# Altium schematic sheet pca10112_sheet8_FEM.SchDoc: Front End Module
size A3; Organization: Nordic Semiconductor; DocumentNumber: 7; SheetNumber: 7; SheetTotal: 7; CompanyName: Nordic Semiconductor; ProjectName: pca10112.PrjPCB
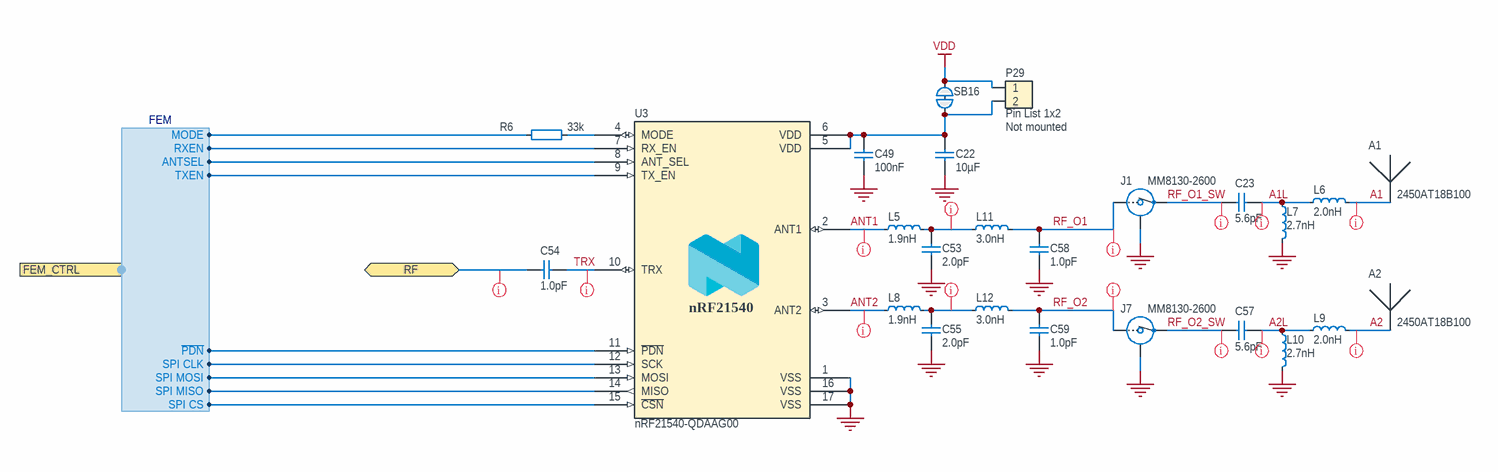
[diagram p0: pca10112_sheet8_FEM.SchDoc]

## Parts
A1  2450AT18B100  [2450AT18B100]
A2  2450AT18B100  [2450AT18B100]
C22  10µF  [CAPC1608X06L]
C23  5.6pF  [CAPC0603X03L_C]
C49  100nF  [CAPC0603X03L_C]
C53  2.0pF  [CAPC0603X03L_C]
C54  1.0pF  [CAPC0603X03L_C]
C55  2.0pF  [CAPC0603X03L_C]
C57  5.6pF  [CAPC0603X03L_C]
C58  1.0pF  [CAPC0603X03L_C]
C59  1.0pF  [CAPC0603X03L_C]
J1  MM8130-2600  [COAXIAL-SWF]
J7  MM8130-2600  [COAXIAL-SWF]
L5  1.9nH  [INDC0603X03L_C]
L6  2.0nH  [INDC0603X03L_C]
L7  2.7nH  [INDC0603X03L_C]
L8  1.9nH  [INDC0603X03L_C]
L9  2.0nH  [INDC0603X03L_C]
L10  2.7nH  [INDC0603X03L_C]
L11  3.0nH  [INDC0603X03L_C]
L12  3.0nH  [INDC0603X03L_C]
P29  Pin List 1x2  Assembly: Not mounted  [LIST_1x2-NC]
R6  33k  [RESC0603X03L_C]
SB16  Solderbridge  [Solderbridge_Shorted]  (value not drawn)  (net tie, no BOM)
U3  nRF21540-QDAAG00  [QFN65P400X400X65_HS-17N]

## Ports
FEM_CTRL (harness FEM), RF (bidir)

## Harnesses
FEM: MODE, RXEN, ANTSEL, TXEN, ~{PDN}, SPI CLK, SPI MOSI, SPI MISO, SPI CS

## Nets
GND: C22.1 C49.1 C53.1 C55.1 C58.1 C59.1 J1.2(Shield) J7.2(Shield) L7.2 L10.2 U3.1(VSS) U3.16(VSS) U3.17(VSS)
VDD: P29.1 SB16.1
A1: A1.1 L6.2
A1L: C23.1 L6.1 L7.1
A2: A2.1 L9.2
A2L: C57.1 L9.1 L10.1
ANT1: L5.1 U3.2(ANT1)
ANT2: L8.1 U3.3(ANT2)
RF: C54.1 ; port RF
RF_O1: C58.2 J1.1(IN) L11.2
RF_O1_SW: C23.2 J1.3(OUT)
RF_O2: C59.2 J7.1(IN) L12.2
RF_O2_SW: C57.2 J7.3(OUT)
TRX: C54.2 U3.10(TRX)
NetC22_2: C22.2 C49.2 P29.2 SB16.2 U3.5(VDD) U3.6(VDD)
NetC53_2: C53.2 L5.2 L11.1
NetC55_2: C55.2 L8.2 L12.1
NetR6_1: R6.1 ; port FEM_CTRL.MODE
NetR6_2: R6.2 U3.4(MODE)
NetU3_7: U3.7(RX_EN) ; port FEM_CTRL.RXEN
NetU3_8: U3.8(ANT_SEL) ; port FEM_CTRL.ANTSEL
NetU3_9: U3.9(TX_EN) ; port FEM_CTRL.TXEN
NetU3_11: U3.11(~{PDN}) ; port FEM_CTRL.~{PDN}
NetU3_12: U3.12(SCK) ; port FEM_CTRL.SPI CLK
NetU3_13: U3.13(MOSI) ; port FEM_CTRL.SPI MOSI
NetU3_14: U3.14(MISO) ; port FEM_CTRL.SPI MISO
NetU3_15: U3.15(~{CSN}) ; port FEM_CTRL.SPI CS

## Layout directives
net class Ant: A1, A1L, A2, A2L, ANT1, ANT2, NetC53_2, NetC55_2, RF, RF_O1, RF_O1_SW, RF_O2, RF_O2_SW, TRX

## Notes on the sheet
- Title
- Size
- Date:
- File:
- A3
- PCB Assembly Number
- Sheet         of
- Drawn By:
- Revision
- Classification:
- (in symbol nRF21540-QDAAG0) nRF21540

## Library data of the parts
A1 A2 = Johanson 2450AT18B100: 2.45 GHz chip antenna; Manufacturer: Johanson Technology; Part number IPS: 00000007781; Part number Norautron: 26583987; Part number NEMS: 100700001; Note: N.A.; Pad Count: 2; Component Status: Active; Part Number: Johanson 2450AT18B100; Manufacturer Part Number: 2450AT18B100; Footprint Doc: 2450AT18B100; LatestRevisionDate: 2013-09-13; Published: 2013-09-13; Value: 2450AT18B100; Artikkelnr Noca: N.A.; ComponentLink1URL: N.A.; ComponentLink1Description: Datasheet; ComponentLink2URL: N.A.; ComponentLink2Description: Supplier link; HelpURL: http://www.johansontechnology.com/datasheets/antennas/2450AT18B100.pdf; Supplier 1: Digi-Key; Supplier Part Number 1: 712-1006-1-ND; Supplier 2: N.A.; Supplier Part Number 2: N.A.; Component Class: Antennas; PartId: 100700001; Author: rsk
C22 = C0603-10µ: Capacitor, X5R, ±20%; Manufacturer: N.A.; Part number IPS: 00000007785; Part number NEMS: 100200275; Note: 6.3V; Artikkelnr Noca: 20039234; Pad Count: 2; Component Status: Active; Part Number: C0603-10µ; Manufacturer Part Number: N.A.; ComponentLink1URL: N.A.; ComponentLink1Description: Datasheet; ComponentLink2URL: N.A.; ComponentLink2Description: Supplier link; HelpURL: N.A.; Footprint Doc: 0603; LatestRevisionDate: 2011-01-17; Published: 2011-01-17; Value: 10µF; Supplier 1: N.A.; Supplier Part Number 1: N.A.; Supplier 2: N.A.; Supplier Part Number 2: N.A.; Component Class: Capacitors; PartId: 100200275; Author: rsk; Part number Norautron: N.A.
C23 C57 = C0201-5.6p: Capacitor, C0G, ±0.05pF, 50V; Manufacturer: N.A.; Part number IPS: 00000004899; Part number NEMS: 100200028; Note: Chip Cap 1%; Pad Count: 2; Component Status: Active; Part Number: C0201-5.6p; Manufacturer Part Number: N.A.; LatestRevisionDate: 2020-10-13; Published: 2014-11-13; Value: 5.6pF; Artikkelnr Noca: N.A.; Footprint Doc: 0201; ComponentLink1URL: N.A.; ComponentLink1Description: Datasheet; ComponentLink2URL: N.A.; ComponentLink2Description: Supplier link; HelpURL: N.A.; Supplier 1: N.A.; Supplier Part Number 1: N.A.; Supplier 2: N.A.; Supplier Part Number 2: N.A.; Component Class: Capacitors; PartId: 100200028; Author: rsk; Part number Norautron: N.A.
C49 = C0201-100n: Capacitor, X5R, ±10%; Manufacturer: N.A.; Part number IPS: 00000001248, 00000002505; Part number Norautron: 262071862; Part number NEMS: 100200078; Note: 16V; Pad Count: 2; Component Status: Active; Part Number: C0201-100n; Manufacturer Part Number: N.A.; ComponentLink1URL: N.A.; ComponentLink1Description: Datasheet; ComponentLink2URL: N.A.; ComponentLink2Description: Supplier link; HelpURL: N.A.; Footprint Doc: 0201; LatestRevisionDate: 2017-11-09; Published: 2014-11-13; Value: 100nF; Artikkelnr Noca: N.A.; Supplier 1: N.A.; Supplier Part Number 1: N.A.; Supplier 2: N.A.; Supplier Part Number 2: N.A.; Component Class: Capacitors; PartId: 100200078; Author: rsk
C53 C55 = C0201-2.0p-HQ-Murata: Capacitor, NP0, ±0.05pF, 25V; Manufacturer: Murata; Manufacturer Part Number: GJM0335C1E2R0WB01; Part number IPS: 00000001775; Part number NEMS: 100200419; Artikkelnr Noca: N.A.; Pad Count: 2; Component Status: Active; Part Number: C0201-2.0p-HQ-Murata; ComponentLink1URL: N.A.; ComponentLink1Description: Datasheet; ComponentLink2URL: N.A.; ComponentLink2Description: Supplier link; HelpURL: https://psearch.en.murata.com/capacitor/product/GJM0335C1E2R0WB01%23.html; Footprint Doc: 0201; LatestRevisionDate: 2018-10-25; Published: 2018-10-25; Value: 2.0pF; Note: 25V; Supplier 1: N.A.; Supplier Part Number 1: N.A.; Supplier 2: N.A.; Supplier Part Number 2: N.A.; Component Class: Capacitors; PartId: 100200419; Author: rsk; Part number Norautron: N.A.
C54 = C0201-1p0: Capacitor, C0G, ±0.1pF, 25V; Manufacturer: Murata; Manufacturer Part Number: GJM0335C1E1R0BB01D; Part number IPS: 00000007964; Part number NEMS: 100200398; Artikkelnr Noca: N.A.; Pad Count: 2; Component Status: Active; Part Number: C0201-1p0; ComponentLink1URL: N.A.; ComponentLink1Description: Datasheet; ComponentLink2Description: Supplier link; HelpURL: http://search.murata.co.jp/Ceramy/image/img/A01X/G101/ENG/GJM0335C1E1R0BB01-01.pdf; Footprint Doc: 0201; LatestRevisionDate: 2020-10-13; Published: 2017-09-21; Value: 1.0pF; Note: ±0.1pF; ComponentLink2URL: N.A.; Supplier 1: Digi-Key; Supplier Part Number 1: 490-11172-1-ND; Supplier 2: N.A.; Supplier Part Number 2: N.A.; Component Class: Capacitors; PartId: 100200398; Author: rsk; Part number Norautron: N.A.
C58 C59 = C0201-1.0p_RF: RF Chip Cap 0201; Manufacturer: N.A.; Part number NEMS: 100200085; Note: High frequency chip capasitors ±5%, NP0; Pad Count: 2; Component Status: Active; Part Number: C0201-1.0p_RF; Manufacturer Part Number: N.A.; ComponentLink1URL: N.A.; ComponentLink1Description: Datasheet; ComponentLink2URL: N.A.; ComponentLink2Description: Supplier link; HelpURL: N.A.; Footprint Doc: 0201; LatestRevisionDate: 2016-04-22; Published: 2016-04-22; Value: 1.0pF; Artikkelnr Noca: N.A.; Part number IPS: N.A.; Supplier 1: N.A.; Supplier Part Number 1: N.A.; Supplier 2: N.A.; Supplier Part Number 2: N.A.; Component Class: Capacitors; PartId: 100200085; Author: rsk; Part number Norautron: N.A.
J1 J7 = MM8130-2600: Coaxial Connector with Switch; Manufacturer: Murata; Part number IPS: 00000009955; Part number Norautron: 26030338; Part number NEMS: 100500400; Note: N.A.; Artikkelnr Noca: 55029011; Pad Count: 3; Component Status: Active; Part Number: MM8130-2600; Manufacturer Part Number: MM8130-2600; LatestRevisionDate: 2014-04-24; Published: 2014-04-24; Value: MM8130-2600; Footprint Doc: COAXIAL-SWF; ComponentLink1URL: N.A.; ComponentLink1Description: Datasheet; ComponentLink2URL: N.A.; ComponentLink2Description: Supplier link; HelpURL: http://www.murata.com/products/catalog/pdf/o33e.pdf; Supplier 1: Digi-Key; Supplier Part Number 1: 490-4981-1-ND; Supplier 2: Mouser; Supplier Part Number 2: 81-MM8130-2600RA2; Component Class: Connectors; PartId: 100500400; Author: rsk
L5 L8 = L0201-1n9-HQ-Murata: Inductor, 600mA, ±0.1ｎH, 120mOhm; Manufacturer: Murata; Manufacturer Part Number: LQP03HQ1N9B02; Part number IPS: 00000004903; Part number NEMS: 100300206; Note: -55°C ~ 125°C; Artikkelnr Noca: N.A.; Pad Count: 2; Component Status: Active; Part Number: L0201-1n9-HQ-Murata; ComponentLink1URL: https://search.murata.co.jp/Ceramy/image/img/P02/JELF243C-0021.pdf; ComponentLink1Description: Datasheet; ComponentLink2Description: Supplier link; HelpURL: https://psearch.en.murata.com/inductor/product/LQP03HQ1N9B02%23.html; Footprint Doc: 0201; LatestRevisionDate: 2018-10-23; Published: 2018-10-23; Value: 1.9nH; ComponentLink2URL: N.A.; Supplier 1: Digi-Key; Supplier Part Number 1: 490-13889-1-ND; Supplier 2: N.A.; Supplier Part Number 2: N.A.; Component Class: Inductors; PartId: 100300206; Author: rsk; Part number Norautron: N.A.
L6 L9 = L0201-2n0-HQ-Murata: Inductor, 600mA, ±0.1ｎH, 120mOhm; Manufacturer: Murata; Manufacturer Part Number: LQP03HQ2N0B02; Part number IPS: 00000001670; Part number NEMS: 100300207; Note: -55°C ~ 125°C; Artikkelnr Noca: N.A.; Pad Count: 2; Component Status: Active; Part Number: L0201-2n0-HQ-Murata; LatestRevisionDate: 2018-10-23; Published: 2018-10-23; Value: 2.0nH; Footprint Doc: 0201; ComponentLink1Description: Datasheet; ComponentLink2Description: Supplier link; ComponentLink1URL: https://search.murata.co.jp/Ceramy/image/img/P02/JELF243C-0021.pdf; HelpURL: https://psearch.en.murata.com/inductor/product/LQP03HQ2N0B02%23.html; ComponentLink2URL: N.A.; Supplier 1: Digi-Key; Supplier Part Number 1: 490-13895-1-ND; Supplier 2: N.A.; Supplier Part Number 2: N.A.; Component Class: Inductors; PartId: 100300207; Author: rsk; Part number Norautron: N.A.
L7 L10 = L0201-2n7-HQ-Murata: Inductor, 600mA, ±0.1ｎH, 120mOhm; Manufacturer: Murata; Manufacturer Part Number: LQP03HQ2N7B02; Part number IPS: 00000001753; Part number NEMS: 100300214; Note: -55°C ~ 125°C; Artikkelnr Noca: N.A.; Pad Count: 2; Component Status: Active; Part Number: L0201-2n7-HQ-Murata; LatestRevisionDate: 2018-10-23; Published: 2018-10-23; Value: 2.7nH; Footprint Doc: 0201; ComponentLink1Description: Datasheet; ComponentLink2Description: Supplier link; ComponentLink1URL: https://search.murata.co.jp/Ceramy/image/img/P02/JELF243C-0021.pdf; HelpURL: https://psearch.en.murata.com/inductor/product/LQP03HQ2N7B02%23.html; ComponentLink2URL: N.A.; Supplier 1: Digi-Key; Supplier Part Number 1: 490-13909-1-ND; Supplier 2: N.A.; Supplier Part Number 2: N.A.; Component Class: Inductors; PartId: 100300214; Author: rsk; Part number Norautron: N.A.
L11 L12 = L0201-3n0-HQ-Murata: Inductor, 600mA, ±0.1ｎH, 120mOhm; Manufacturer: Murata; Manufacturer Part Number: LQP03HQ3N0B02; Part number NEMS: 100300217; Note: -55°C ~ 125°C; Artikkelnr Noca: N.A.; Pad Count: 2; Component Status: Active; Part Number: L0201-3n0-HQ-Murata; ComponentLink1URL: https://search.murata.co.jp/Ceramy/image/img/P02/JELF243C-0021.pdf; ComponentLink1Description: Datasheet; ComponentLink2Description: Supplier link; HelpURL: https://psearch.en.murata.com/inductor/product/LQP03HQ3N0B02%23.html; Footprint Doc: 0201; LatestRevisionDate: 2018-10-23; Published: 2018-10-23; Value: 3.0nH; Part number IPS: N.A.; ComponentLink2URL: N.A.; Supplier 1: Digi-Key; Supplier Part Number 1: 490-13915-1-ND; Supplier 2: N.A.; Supplier Part Number 2: N.A.; Component Class: Inductors; PartId: 100300217; Author: rsk; Part number Norautron: N.A.
P29 = Pin List 1x2, N.C.: Pin List 1x2, 2.54mm (100mil); Manufacturer: N.A.; Part number NEMS: 100500298; Pad Count: 2; Component Status: Active; Part Number: Pin List 1x2, N.C.; Manufacturer Part Number: N.A.; Footprint Doc: LIST_1x2; LatestRevisionDate: 2017-02-02; Published: 2017-01-30; Value: Pin List 1x2; Note: N.A.; Artikkelnr Noca: N.A.; Part number IPS: N.A.; ComponentLink1URL: N.A.; ComponentLink1Description: Datasheet; ComponentLink2URL: N.A.; ComponentLink2Description: Supplier link; HelpURL: N.A.; Supplier 1: N.A.; Supplier Part Number 1: N.A.; Supplier 2: N.A.; Supplier Part Number 2: N.A.; Component Class: Connectors; PartId: 100500298; Author: rsk; Part number Norautron: N.A.
R6 = R0201-33k: Resistor, ±1%, 0.05W; Manufacturer: N.A.; Part number IPS: 00000001708; Part number NEMS: 100100073; Note: Chip Res 1%; Pad Count: 2; Component Status: Active; Part Number: R0201-33k; Manufacturer Part Number: N.A.; LatestRevisionDate: 2014-11-13; Published: 2014-11-13; Value: 33k; Artikkelnr Noca: N.A.; Footprint Doc: 0201; ComponentLink1URL: N.A.; ComponentLink1Description: Datasheet; ComponentLink2URL: N.A.; ComponentLink2Description: Supplier link; HelpURL: N.A.; Supplier 1: N.A.; Supplier Part Number 1: N.A.; Supplier 2: N.A.; Supplier Part Number 2: N.A.; Component Class: Resistors; PartId: 100100073; Author: rsk; Part number Norautron: N.A.
SB16 = Solderbridge Shorted: Shorted Solderbridge; Manufacturer: N.A.; Part number NEMS: 100500459; Pad Count: 2; Component Status: Active; Part Number: Solderbridge Shorted; Manufacturer Part Number: N.A.; LatestRevisionDate: 2012-08-07; Published: 2012-08-07; Value: Solderbridge; Note: N.A.; Artikkelnr Noca: N.A.; Footprint Doc: Solderbridge_Shorted; Part number IPS: N.A.; ComponentLink1URL: N.A.; ComponentLink1Description: Datasheet; ComponentLink2URL: N.A.; ComponentLink2Description: Supplier link; HelpURL: N.A.; Supplier 1: N.A.; Supplier Part Number 1: N.A.; Supplier 2: N.A.; Supplier Part Number 2: N.A.; Component Class: Connectors; PartId: 100500459; Author: rsk; Part number Norautron: N.A.
U3 = nRF21540-QDAAG0: Radio front-end / range extender for 2.4GHz; Manufacturer: Nordic Semiconductor; Part number NEMS: 102000223; Artikkelnr Noca: N.A.; Pad Count: 16; Component Status: Active; Author: hany; Component Class: nRF_Devices; ComponentLink1Description: Datasheet; ComponentLink1URL: N.A.; ComponentLink2Description: Supplier link; ComponentLink2URL: N.A.; Footprint Doc: QFN-16; HelpURL: N.A.; LatestRevisionDate: 2021-03-24; Manufacturer Part Number: nRF21540-QDAAG00; Note: N.A.; Part number IPS: N.A.; Part number Norautron: N.A.; Published: 2021-03-24; Supplier 1: Nordic Semiconductor; Supplier 2: N.A.; Supplier Part Number 1: nRF21540-QDAAG00; Supplier Part Number 2: N.A.; Value: nRF21540-QDAAG00; Part Number: nRF21540-QDAAG0; PartId: 102000223